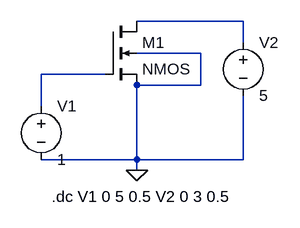
[diagram p0: schematic nmos4_circuit_diagram.asc]
nmos4_circuit_diagram.asc, the LTspice schematic file:
Version 4
SHEET 1 880 680
WIRE 304 208 144 208
WIRE 304 240 304 208
WIRE 240 256 144 256
WIRE 96 288 0 288
WIRE 240 304 240 256
WIRE 240 304 144 304
WIRE 0 336 0 288
WIRE 144 416 144 304
WIRE 144 416 0 416
WIRE 304 416 304 320
WIRE 304 416 144 416
WIRE 144 432 144 416
FLAG 144 432 0
SYMBOL nmos4 96 208 R0
SYMATTR InstName M1
SYMBOL voltage 0 320 R0
WINDOW 123 0 0 Left 0
WINDOW 39 0 0 Left 0
SYMATTR InstName V1
SYMATTR Value 1
SYMBOL voltage 304 224 R0
WINDOW 123 0 0 Left 0
WINDOW 39 0 0 Left 0
SYMATTR InstName V2
SYMATTR Value 5
TEXT 16 472 Left 0 !.dc V1 0 5 0.5 V2 0 3 0.5

The netlist it stands for:
* nmos4_circuit_diagram.asc
M1 N001 N002 0 0 NMOS
V1 N002 0 1
V2 N001 0 5
.model NMOS NMOS
.model PMOS PMOS
.lib standard.mos
.dc V1 0 5 0.5 V2 0 3 0.5
.backanno
.end